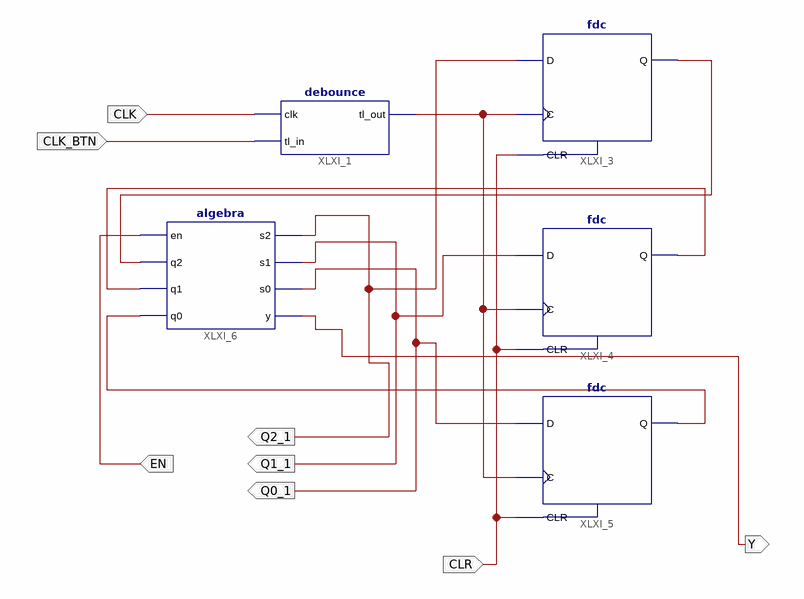
[diagram p0: schematic sheet 1]
// Xilinx ISE schematic modulo6.sch (spartan3e) as structural Verilog: 5 symbols, 8 ports
module modulo6 (
  input  CLR,
  input  CLK,
  input  CLK_BTN,
  input  EN,
  output Q2_1,
  output Q1_1,
  output Q0_1,
  output Y
);

  wire XLXN_8, XLXN_9, XLXN_10, XLXN_11;

  fdc XLXI_4 (.C(XLXN_8), .CLR(CLR), .D(Q1_1), .Q(XLXN_10));
  fdc XLXI_3 (.C(XLXN_8), .CLR(CLR), .D(Q2_1), .Q(XLXN_9));
  debounce XLXI_1 (.clk(CLK), .tl_in(CLK_BTN), .tl_out(XLXN_8));
  fdc XLXI_5 (.C(XLXN_8), .CLR(CLR), .D(Q0_1), .Q(XLXN_11));
  algebra XLXI_6 (.en(EN), .q2(XLXN_9), .q1(XLXN_10), .q0(XLXN_11), .s2(Q2_1), .s1(Q1_1), .s0(Q0_1), .y(Y));
endmodule
